# EAGLE design BUZZI-39 (EAGLE 4.15)
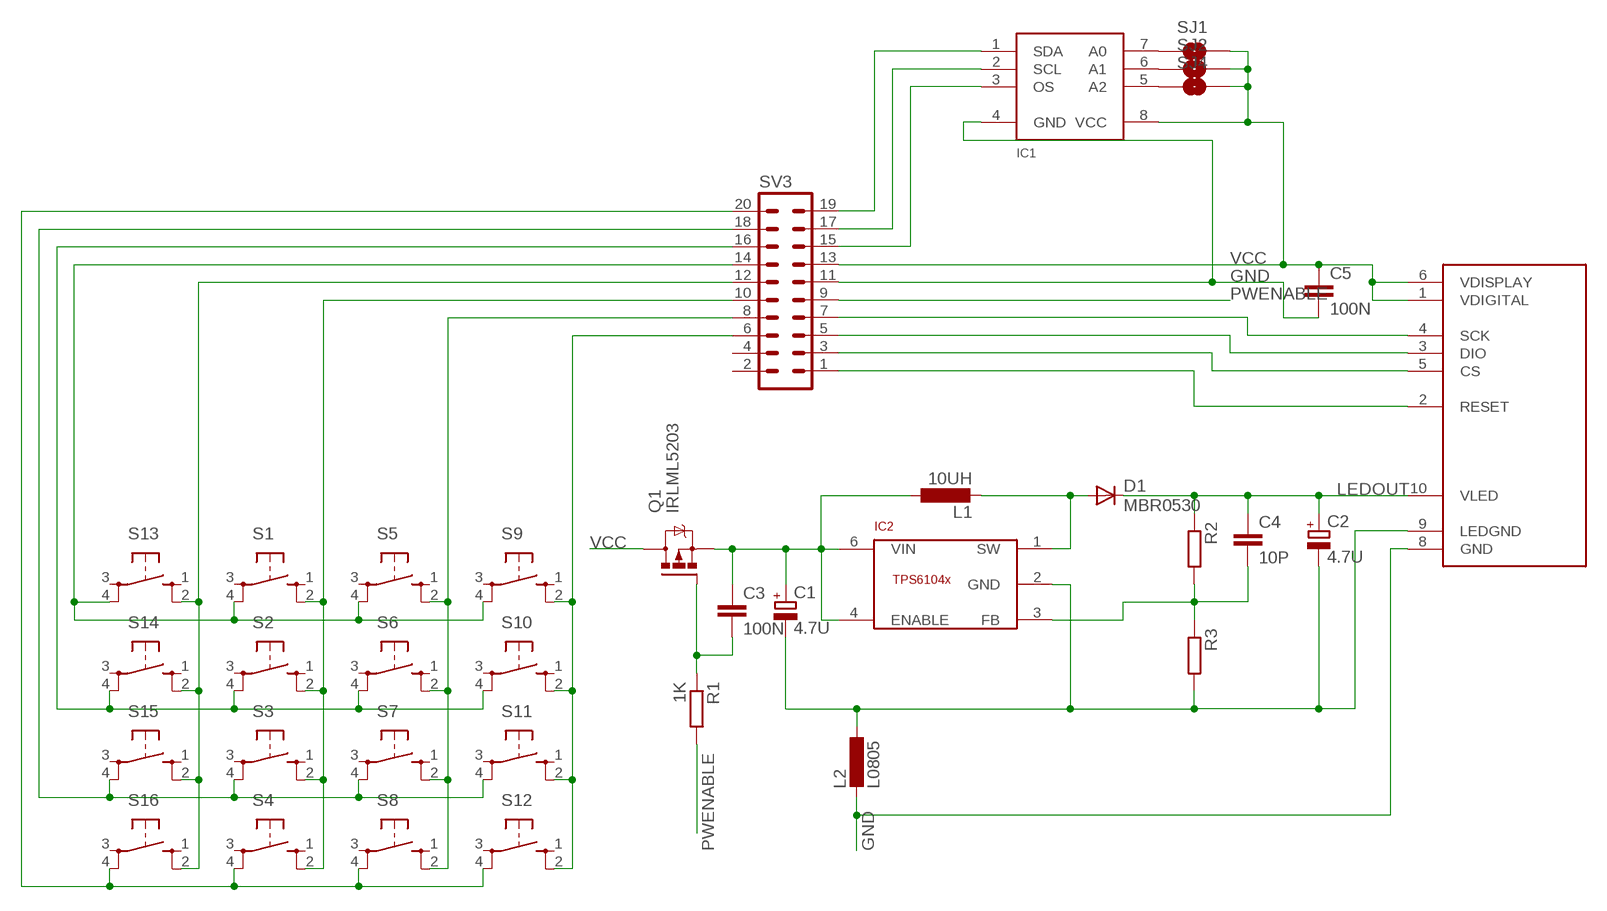
[diagram p0: schematic, sheet 1]

## Parts
C1  4.7U  CPOL-EUCT3528  [CT3528]
C2  4.7U  CPOL-EUCT3528  [CT3528]
C3  100N  C-EUC0805  [C0805]
C4  10P  C-EUC0805  [C0805]
C5  100N  C-EUC0805  [C0805]
D1  MBR0530  ES2D  [SMB]
IC1  SE95  [MSOP8]
IC2  TPS6104X  [SOT23-6L]
L1  10UH  L1210  [C1210]
L2  L0805  [C0805]
Q1  IRLML5203  [MICRO3]
R1  1K  R-EU_M0805  [M0805]
R2  R-EU_M0805  [M0805]
R3  R-EU_M0805  [M0805]
S1  10XX  [B3F-10XX]
S2  10XX  [B3F-10XX]
S3  10XX  [B3F-10XX]
S4  10XX  [B3F-10XX]
S5  10XX  [B3F-10XX]
S6  10XX  [B3F-10XX]
S7  10XX  [B3F-10XX]
S8  10XX  [B3F-10XX]
S9  10XX  [B3F-10XX]
S10  10XX  [B3F-10XX]
S11  10XX  [B3F-10XX]
S12  10XX  [B3F-10XX]
S13  10XX  [B3F-10XX]
S14  10XX  [B3F-10XX]
S15  10XX  [B3F-10XX]
S16  10XX  [B3F-10XX]
SJ1  SOLDERJUMPERNC  [SJ-NC]
SJ2  SOLDERJUMPERNC  [SJ-NC]
SJ4  SOLDERJUMPERNC  [SJ-NC]
SV3  MA10-2  [MA10-2]
U$1  NOKIA6100_LCD  [NOKIA6100_LCD]

## Nets
GND: C5.2 IC1.4(GND) L2.2 SV3.11 U$1.8(GND)
LEDOUT: C2.+ C4.1 D1.C R2.1 U$1.10(VLED)
N$1: S1.4 S5.4 S9.4 S13.4 SV3.14
N$2: S3.4 S7.4 S11.4 S15.4 SV3.18
N$3: S4.4 S8.4 S12.4 S16.4 SV3.20
N$4: S2.4 S6.4 S10.4 S14.4 SV3.16
N$5: S13.2 S14.2 S15.2 S16.2 SV3.12
N$6: S1.2 S2.2 S3.2 S4.2 SV3.10
N$7: S5.2 S6.2 S7.2 S8.2 SV3.8
N$8: S9.2 S10.2 S11.2 S12.2 SV3.6
N$9: IC1.3(OS) SV3.15
N$10: IC1.7(A0) SJ1.1
N$11: IC1.6(A1) SJ2.1
N$13: IC1.5(A2) SJ4.1
N$15: IC1.1(SDA) SV3.19
N$16: IC1.2(SCL) SV3.17
N$19: C3.2 Q1.1(G) R1.1
N$20: C1.+ C3.1 IC2.4(ENABLE) IC2.6(VIN) L1.1 Q1.2(S)
N$21: C1.- C2.- IC2.2(GND) L2.1 R3.2 U$1.9(LEDGND)
N$22: D1.A IC2.1(SW) L1.2
N$23: SV3.7 U$1.4(SCK)
N$24: C4.2 IC2.3(FB) R2.2 R3.1
N$25: SV3.5 U$1.3(DIO)
N$26: SV3.3 U$1.5(CS)
N$27: SV3.1 U$1.2(RESET)
PWENABLE: R1.2 SV3.9
VCC: C5.1 IC1.8(VCC) Q1.3(D) SJ1.2 SJ2.2 SJ4.2 SV3.13 U$1.1(VDIGITAL) U$1.6(VDISPLAY)
Unconnected: S1.1 S1.3 S2.1 S2.3 S3.1 S3.3 S4.1 S4.3 S5.1 S5.3 S6.1 S6.3 S7.1 S7.3 S8.1 S8.3 S9.1 S9.3 S10.1 S10.3 S11.1 S11.3 S12.1 S12.3 S13.1 S13.3 S14.1 S14.3 S15.1 S15.3 S16.1 S16.3 SV3.2 SV3.4

## Library data of the parts
C1 C2 = rcl:CPOL-EU: POLARIZED CAPACITOR, European symbol
C3-C5 = rcl:C-EU: CAPACITOR, European symbol
D1 = diode:ES2D: DIODE super fast rectifier, 2 A
IC1 = turbod3:SE95
IC2 = turbod3:TPS6104X
L1 L2 = turbod3:L
Q1 = transistor-power:IRLML5203: HEXFET P-Channel Power MOSFET
R1-R3 = rcl:R-EU_: RESISTOR, European symbol
S1-S16 = KEY_B:10XX
SJ1 SJ2 SJ4 = SparkFunEagle-6-6-07:SOLDERJUMPER: Solder Jumper Standard SMD solder jumper. Used to automate production. Two varients : Normally Open and Normally Closed are the same, but have different paste layers. NC will have a large amount of paste and should jumper during reflow.
SV3 = con-lstb:MA10-2: PIN HEADER
U$1 = SparkFunEagle-6-6-07:NOKIA6100_LCD: Nokia 6100 Color LCD Schematic element and footprint production proven but could use some touching up. Spark Fun Electronics SKU : LCD-00569. Mating SMD connector : LCD-00570

## Board
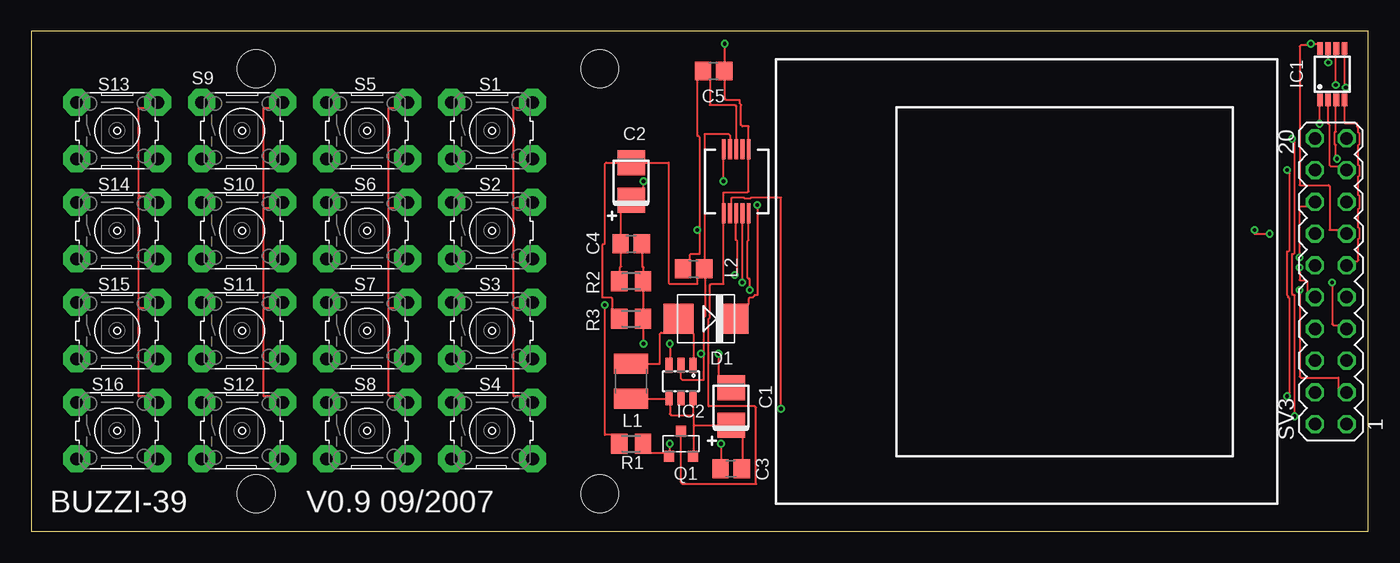
[diagram p1: board, top side]
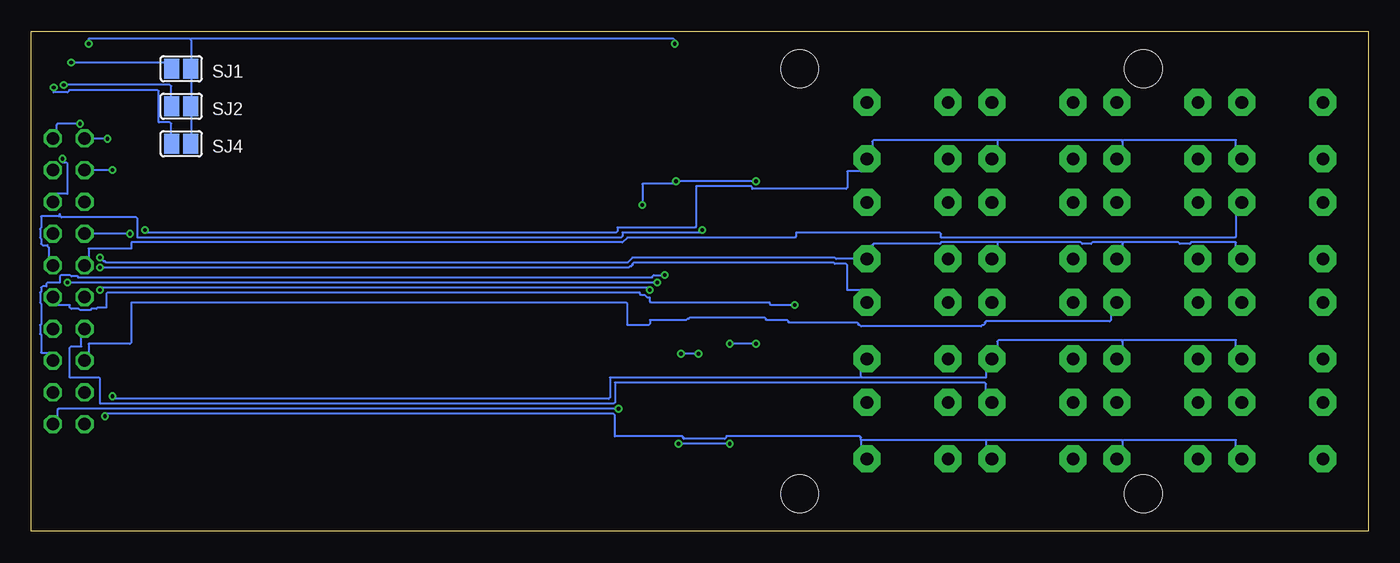
[diagram p2: board, bottom side, seen from below]

Size 107 x 40 mm. Coordinates in mm from the lower left corner, seen from the top.
Outline: 0,0 107,0 107,40 0,40 0,0
Copper layers (1*16): Top 0.035mm / dielectric 1.5mm / Bottom 0.035mm
Design rules "PCB-POOL": minimum track width 6mil, minimum drill 12mil, track to track 6mil, track to pad 6mil, pad to pad 6mil, via to via 6mil, smd to smd 6mil, copper to edge 20mil, drill to drill 8mil, minimum pad ring 8mil, minimum via ring 6mil, stop-mask expansion 3mil, vias tented up to drill 0mil, thermal gap 8mil
Holes 3 mm at 45.5,3 45.5,37 18,37 18,3

### Footprints (pad centres in the part's own frame; a part is rotated, then mirrored left to right if it is on the bottom)
CT3528 = smd 2 x 2.2: + 1.5,0; - -1.5,0
C0805 = smd 1.3 x 1.5: 1 -0.85,0; 2 0.85,0
SMB = smd 2.4 x 2.4: A 2.2,0; C -2.2,0
MSOP8 = smd 0.45 x 1: 1 -0.975,-2.05; 2 -0.325,-2.05; 3 0.325,-2.05; 4 0.975,-2.05; 5 0.975,2.05; 6 0.325,2.05; 7 -0.325,2.05; 8 -0.975,2.05
SOT23-6L = smd 0.55 x 1.2: 1 -0.95,-1.3; 2 0,-1.3; 3 0.95,-1.3; 4 0.95,1.3; 5 0,1.3; 6 -0.95,1.3
C1210 = smd 1.6 x 2.7: 1 -1.4,0; 2 1.4,0
MICRO3 = smd 0.8 x 0.9: 1 -0.95,-1; 2 0.95,-1; 3 0,1
M0805 = smd 1.3 x 1.6: 1 -0.95,0; 2 0.95,0
B3F-10XX = drill 1.016 pad 2.159 octagon: 1 -3.379,2.312; 2 3.123,2.312; 3 -3.379,-2.209; 4 3.123,-2.209
SJ-NC = smd 1.168 x 1.6: 1 -0.762,0; 2 0.762,0
MA10-2 = drill 1.016 octagon: 1 -11.43,-1.27; 2 -11.43,1.27; 3 -8.89,-1.27; 4 -8.89,1.27; 5 -6.35,-1.27; 6 -6.35,1.27; 7 -3.81,-1.27; 8 -3.81,1.27; 9 -1.27,-1.27; 10 -1.27,1.27; 11 1.27,-1.27; 12 1.27,1.27; 13 3.81,-1.27; 14 3.81,1.27; 15 6.35,-1.27; 16 6.35,1.27; 17 8.89,-1.27; 18 8.89,1.27; 19 11.43,-1.27; 20 11.43,1.27
NOKIA6100_LCD = smd 1.6 x 0.3: 1 24.255,44.311; 2 24.255,43.811; 3 24.255,43.311; 4 24.255,42.811; 5 24.255,42.311; 6 29.389,42.303; 7 29.389,42.803; 8 29.389,43.303; 9 29.389,43.803; 10 29.389,44.303

### Placement (x,y rotation side)
C1  56,10 270 top
C2  48,28 270 top
C3  56,5 180 top
C4  48,23 0 top
C5  54.6,36.82 180 top
D1  54,17 180 top
IC1  104.11,36.56 0 top
IC2  52,12 180 top
L1  48,12 90 top
L2  53,21 180 top
Q1  52,7 0 top
R1  48,7 180 top
R2  48,20 0 top
R3  48,17 180 top
S1  37,32 0 top
S2  37,24 0 top
S3  37,16 0 top
S4  37,8 0 top
S5  27,32 0 top
S6  27,24 0 top
S7  27,16 0 top
S8  27,8 0 top
S9  17,32 0 top
S10  17,24 0 top
S11  17,16 0 top
S12  17,8 0 top
S13  7,32 0 top
S14  7,24 0 top
S15  7,16 0 top
S16  7,8 0 top
SJ1  95,37 0 bottom
SJ2  95,34 0 bottom
SJ4  95,31 0 bottom
SV3  104,20 90 top
U$1  99.73,1.17 90 top

### Tracks (layer width: path | path; a pad name or v marks a point on that pad's centre or on a via)
GND  (via drill 0.3)
  Top 0.152: IC1.4 105.1,34.1 105.1,32.7 105.2,32.6 106.1,32.6 106.1,32.4 106.2,32.3 106.2,31.9 106.3,31.8 106.3,31 106.2,30.9 106.2,29.3 106.3,29.2 106.3,28.5 106.2,28.4 106.2,26.9 106.3,26.8 106.3,25.9 106.2,25.8 106.2,24.3 106.3,24.2 106.3,23.5 106.2,23.4 106.2,21.7 106.1,21.6 105.9,21.6 SV3.11 | 53.5,24.1 53.5,31.5 53.4,31.6 53.3,31.6 53.3,36.1 C5.2 54.3,36.1 54.3,34.1 56.3,34.1 56.4,34 56.4,31.3 U$1.8 | 53.5,24.1 53.5,22.2 52.8,22.2 52.7,22.1 52.7,21.7 L2.2 | 53.5,24.1 v53.3,24.1
  Bottom 0.152: 104.75,25.25 104.8,25.2 106.2,25.2 106.2,24.3 106.3,24.2 106.3,23.5 106.2,23.4 106.2,23 106.1,22.9 105.7,22.9 105.7,22.8 105.6,22.7 105.6,21.9 SV3.11 | 104.75,25.25 104.7,25.3 104.7,25.4 | v53.3,24.1 53.3,24 53.4,23.9 59.7,23.9 59.7,23.6 59.8,23.5 98.5,23.5 98.5,25 98.6,25.1 104.6,25.1 104.75,25.25
LEDOUT  (via drill 0.3)
  Top 0.152: R2.1 47.1,20.7 47.1,21.1 47.2,21.2 47.2,22.3 C4.1 47.2,23.7 47.2,25.6 C2.+ 49,27.4 v49,28 | v55.4,28 55.4,29.8 U$1.10 | v58.1,26.1 58.1,18.9 57.9,18.9 57.7,18.7 57.5,18.7 57.4,18.6 57.4,18.2 D1.C
  Bottom 0.152: v49,28 v55.4,28 55.6,27.8 58.1,27.8 v58.1,26.1
N$1  (via drill 0.3)
  Top 0.152: v99.1,23.8 97.9,23.8 v97.9,24.1
  Bottom 0.152: 19.65,31.25 19.7,31.2 19.7,30.8 S9.4 | 19.65,31.25 19.6,31.3 10.6,31.3 10.6,30.8 S13.4 | 29.7,31.3 29.7,30.8 S5.4 | 29.7,31.3 19.7,31.3 19.65,31.25 | 29.7,31.3 39.6,31.3 39.7,31.2 39.7,30.8 S1.4 40.6,28.8 41.7,28.8 41.7,27.5 41.8,27.4 49.3,27.4 49.3,27.5 49.4,27.6 53.8,27.6 53.8,24.4 53.9,24.3 60.1,24.3 60.1,24 60.2,23.9 97.9,23.9 v97.9,24.1 | v99.1,23.8 102.1,23.8 SV3.14
N$2  (via drill 0.3)
  Top 0.152: v100.5,28.9 100.7,28.9 100.7,22.5 100.6,22.4 100.5,22.4 100.5,18.9 100.6,18.8 100.6,18.7 100.7,18.6 100.7,10.9 100.6,10.8 v100.5,10.8
  Bottom 0.152: 19.65,15.25 19.7,15.2 19.7,14.8 S11.4 | 19.65,15.25 19.6,15.3 10.6,15.3 10.6,14.8 S15.4 | v100.5,28.9 102.1,28.9 SV3.18 | v100.5,10.8 100.5,10.6 60.8,10.6 60.7,10.7 60.7,12.3 40.7,12.3 40.65,12.35 | 40.65,12.35 40.6,12.4 40.6,12.8 S3.4 | 40.65,12.35 40.6,12.3 30.6,12.3 30.6,12.8 S7.4 29.7,14.8 29.7,15.2 29.6,15.3 19.7,15.3 19.65,15.25
N$3  (via drill 0.3)
  Top 0.152: v100.9,31.4 101.1,31.4 101.1,22.3 101,22.2 100.9,22.2 100.9,19 101,18.9 101.1,18.9 v101.1,9.2
  Bottom 0.152: 19.65,7.25 19.7,7.2 19.7,6.8 S12.4 | 19.65,7.25 19.6,7.3 10.6,7.3 10.6,6.8 S16.4 | v100.9,31.4 102.1,31.4 SV3.20 | v101.1,9.2 101.1,9.4 60.4,9.4 60.3,9.3 60.3,7.6 54.9,7.6 54.8,7.5 54.8,7.4 51.5,7.4 51.4,7.5 51.4,7.6 40.7,7.6 40.6,7.5 40.6,7.3 | 40.6,7.3 40.6,6.8 S4.4 | 30.6,7.3 30.6,6.8 S8.4 | 30.6,7.3 40.6,7.3 | 30.6,7.3 19.7,7.3 19.65,7.25
N$4  (via drill 0.3)
  Top 0.152: v101.5,21.9 101.5,26 102.1,26 SV3.16
  Bottom 0.152: 19.65,23.05 19.7,23 19.7,22.8 S10.4 | 19.65,23.05 19.6,23.1 15.2,23.1 15.1,23 14.3,23 14.2,23.1 10.6,23.1 10.6,22.8 S14.4 | 29.7,23.1 29.7,22.8 S6.4 | 29.7,23.1 23,23.1 22.9,23 22.2,23 22.1,23.1 19.7,23.1 19.65,23.05 | v101.5,21.9 101.5,21.7 101.3,21.7 101.2,21.6 101.1,21.6 101,21.5 59.3,21.5 58.9,21.9 42.7,21.9 42.6,21.8 41.2,21.8 S2.4 39.7,22.8 39.7,22.9 39.6,23 34.3,23 34.2,23.1 29.7,23.1
N$5
  Top 0.152: 8.65,17.85 8.7,17.9 9.1,17.9 S15.2 | 8.65,17.85 8.6,17.8 8.6,10.8 9.1,10.8 S16.2 | 8.65,26.85 8.7,26.8 9.1,26.8 S14.2 | 8.65,26.85 8.6,26.9 8.6,33.9 9.1,33.9 S13.2 | 8.65,17.85 8.6,17.9 8.6,26.8 8.65,26.85
  Bottom 0.152: SV3.12 102.4,21.9 102.4,22.6 99,22.6 99,23.1 59.7,23.1 59.3,23.5 45.9,23.5 45.8,23.6 45.8,23.9 34.3,23.9 34.2,23.8 34.2,23.5 10.7,23.5 10.6,23.6 10.6,25.3 S14.2
N$6  (via drill 0.3)
  Top 0.152: v101.5,21.1 101.5,20.1 102,20.1 102.1,20 102.1,19.1 SV3.10 | 38.65,17.85 38.7,17.9 39.1,17.9 S3.2 | 38.65,17.85 38.6,17.8 38.6,10.8 39.1,10.8 S4.2 | 38.6,25.9 39.1,25.9 S2.2 | 38.6,25.9 38.6,17.9 38.65,17.85 | 38.6,25.9 38.6,33.9 39.1,33.9 S1.2
  Bottom 0.152: v101.5,21.1 59.2,21.1 59.1,21.2 59,21.2 58.9,21.3 58.9,21.4 58.8,21.5 42.8,21.5 42.7,21.4 41.8,21.4 41.7,21.3 41.7,19.3 40.6,19.3 S3.2
N$7
  Top 0.152: 28.6,17.9 29.1,17.9 S7.2 | 28.6,17.9 28.6,10.9 28.7,10.8 29.1,10.8 S8.2 | 28.6,25.9 29.1,25.9 S6.2 | 28.6,17.9 28.6,25.9 | 28.6,25.9 28.6,33.9 29.1,33.9 S5.2
  Bottom 0.152: SV3.8 103,15.5 103,14.8 103.8,14.8 103.9,14.7 103.9,12.3 101.6,12.3 101.5,12.2 101.5,10.2 60.4,10.2 60.3,10.3 60.3,11.9 30.7,11.9 30.6,11.8 30.6,11.3 S8.2
N$8
  Top 0.152: 18.65,17.85 18.7,17.9 19.1,17.9 S11.2 | 18.65,17.85 18.6,17.8 18.6,10.8 19.1,10.8 S12.2 | 18.6,25.9 19.1,25.9 S10.2 | 18.6,25.9 18.6,17.9 18.65,17.85 | 18.6,25.9 18.6,33.9 19.1,33.9 S9.2
  Bottom 0.152: SV3.6 102.4,14.3 102.4,15 99.1,15 99,15.1 99,18.3 59.4,18.3 59.3,18.2 59.3,16.5 57.6,16.5 57.5,16.6 57.5,16.9 54.6,16.9 54.5,17 54.4,17 54.3,17.1 48.3,17.1 48.2,17 48.2,16.9 46.5,16.9 46.4,16.8 46.4,16.7 40.9,16.7 40.8,16.6 40.8,16.5 40.7,16.5 40.6,16.4 31,16.4 30.9,16.5 30.8,16.5 30.7,16.6 30.7,16.7 30.6,16.8 20.7,16.8 20.6,16.9 20.6,17.3 S11.2
N$9  (via drill 0.3)
  Top 0.152: v104.5,29.8 104.4,29.9 104.4,30.9 104.3,31 104.3,31.9 104.4,32 104.4,34.1 IC1.3
  Bottom 0.152: v104.5,29.8 104.5,29.5 104.2,29.5 104.1,29.4 104.1,27 105,27 SV3.15
N$10  (via drill 0.3)
  Top 0.152: v103.8,37.5 103.8,38.2 IC1.7
  Bottom 0.152: v103.8,37.5 96.3,37.5 SJ1.1
N$11  (via drill 0.3)
  Top 0.152: v104.4,35.7 104.4,38.2 IC1.6
  Bottom 0.152: v104.4,35.7 95.9,35.7 95.8,35.6 95.8,34.8 SJ2.1
N$13  (via drill 0.3)
  Top 0.152: v105.2,35.5 105.1,35.6 105.1,38.2 IC1.5
  Bottom 0.152: v105.2,35.5 105.2,35.1 104.1,35.1 104,35.2 104,35.3 96.9,35.3 96.8,35.2 96.8,32.7 95.9,32.7 95.8,32.6 95.8,31.8 SJ4.1
N$15  (via drill 0.3)
  Top 0.152: v103.1,32.6 103.1,34.1 IC1.1
  Bottom 0.152: v103.1,32.6 104.9,32.6 105,32.5 105,32.1 SV3.19
N$16
  Top 0.152: IC1.2 103.8,34.1 103.8,32.6 103.9,32.5 103.9,29.3 104,29.2 104.6,29.2 SV3.17
N$19  (via drill 0.3)
  Top 0.152: R1.1 49.5,6.3 50.7,6.3 Q1.1 51.1,6.4 v51.1,7 | v55.2,7 55.2,5.7 C3.2
  Bottom 0.152: v51.1,7 v55.2,7
N$20
  Top 0.152: L1.1 50.8,10.6 IC2.4 51.1,10.2 51.1,9.4 51.2,9.3 53,9.3 | 53,9.3 53,10.2 IC2.6 | 53,9.3 53,8.5 | 53,8.5 53,6.4 Q1.2 | C3.1 56.9,5.7 56.9,7.6 C1.+ 53,8.5
N$21  (via drill 0.3)
  Top 0.152: R3.2 46.5,17.7 46.5,18.6 46.4,18.7 45.7,18.7 45.7,22.9 45.8,23 45.9,23 45.9,29.4 46,29.5 C2.- 51,29.5 51,19.9 51.1,19.8 53.3,19.8 53.3,20.3 L2.1 | 53.8,14.2 53.8,17.1 53.9,17.2 53.9,20.3 L2.1 | 53.8,14.2 53.8,12.1 52.1,12.1 52,12.2 IC2.2 | U$1.9 55.9,31.3 55.9,31.7 55.8,31.8 53.9,31.8 53.9,21.7 L2.1 | v55,14.2 55,12.4 C1.- | 53.8,14.2 v53.6,14.2
  Bottom 0.152: v53.6,14.2 v55,14.2
N$22
  Top 0.152: IC2.1 53,13.8 53,15.8 D1.A 50.7,15.9 50.4,15.9 50.3,15.8 50.3,13.4 L1.2
N$23  (via drill 0.3)
  Top 0.152: v56.9,19.9 56.9,24.7 U$1.4 | v104.1,19.9 104.1,16.6 104.2,16.5 104.6,16.5 SV3.7
  Bottom 0.152: v56.9,19.9 v104.1,19.9
N$24  (via drill 0.3)
  Top 0.152: C4.2 48.9,22.3 48.9,21.2 49,21.1 49,20.7 R2.2 49,19.3 49,17.7 R3.1 49,16.3 v49,15 | v51.1,15 51.1,13.8 IC2.3
  Bottom 0.152: v49,15 v51.1,15
N$25  (via drill 0.3)
  Top 0.152: v56.3,20.5 56.4,20.5 56.5,20.6 56.5,23.2 56.4,23.3 56.4,24.7 U$1.3
  Bottom 0.152: v56.3,20.5 57.2,20.5 57.3,20.4 57.3,20.3 103.2,20.3 103.3,20.4 103.8,20.4 103.9,20.5 104.6,20.5 104.7,20.4 104.7,19.9 105.7,19.9 105.8,19.8 105.8,19.6 106.1,19.6 106.2,19.5 106.2,19.2 106.3,19.1 106.3,18.3 106.2,18.2 106.2,16.6 106.3,16.5 106.3,15.8 106.2,15.7 106.2,14.3 105.6,14.3 SV3.5
N$26  (via drill 0.3)
  Top 0.152: v57.5,19.3 57.5,20.2 57.4,20.2 57.3,20.3 57.3,23.2 57.4,23.3 57.4,24.7 U$1.5 | v101.5,19.3 101.5,12.4 101.6,12.3 104.6,12.3 104.6,11.4 SV3.3
  Bottom 0.152: v57.5,19.3 57.5,19.5 101.4,19.5 101.5,19.4 v101.5,19.3
N$27  (via drill 0.3)
  Top 0.152: v60,9.8 60,26.7 57.6,26.7 57.5,26.6 57.1,26.6 57,26.7 56.1,26.7 56,26.6 56,26.2 U$1.2
  Bottom 0.152: v60,9.8 104.8,9.8 104.9,9.7 104.9,9.2 SV3.1
PWENABLE  (via drill 0.3)
  Top 0.152: v45.9,18.1 45.9,7.7 46.5,7.7 R1.2
  Bottom 0.152: v45.9,18.1 47.8,18.1 47.9,18.2 47.9,18.3 57.4,18.3 57.5,18.4 57.5,18.7 57.7,18.7 57.9,18.9 58.2,18.9 58.3,19 58.3,19.1 100.9,19.1 101,19 101,17.9 101.7,17.9 101.8,17.8 102.2,17.8 102.3,17.7 103.1,17.7 103.2,17.8 103.8,17.8 103.9,17.9 103.9,18.1 104.9,18.1 SV3.9
VCC  (via drill 0.3)
  Top 0.152: IC1.8 103,39 v102.4,39 102.1,38.9 101.6,38.9 101.5,38.8 101.5,27.7 103.8,27.7 103.9,27.6 103.9,24.1 104.6,24.1 SV3.13 | Q1.3 52,3.9 52.1,3.8 58,3.8 58,9.9 57.9,10 54.2,10 54.2,17 54.3,17.1 54.3,19.7 54.4,19.8 55.4,19.8 55.4,24.7 U$1.1 55.4,26.2 55.4,27.1 57.3,27.1 57.4,27.2 57.4,29.8 U$1.6 57.4,31.3 57.4,32.4 56.9,32.4 56.8,32.5 56.8,34.1 56.7,34.2 56.7,34.5 55.6,34.5 55.5,34.6 55.5,36.1 C5.1 55.5,37.5 v55.5,39
  Bottom 0.152: SJ4.2 94.2,31.8 94.2,33.2 SJ2.2 94.2,34.8 94.2,36.2 SJ1.2 94.2,37.8 94.2,39.3 94.25,39.35 | v102.4,39 102.4,39.4 94.3,39.4 94.25,39.35 | v55.5,39 55.5,39.3 55.6,39.4 94.2,39.4 94.25,39.35

### Text on the board
tNames: BUZZI-39 | V0.9 09/2007